# Altium schematic sheet ServoBoard.SchDoc
size A4
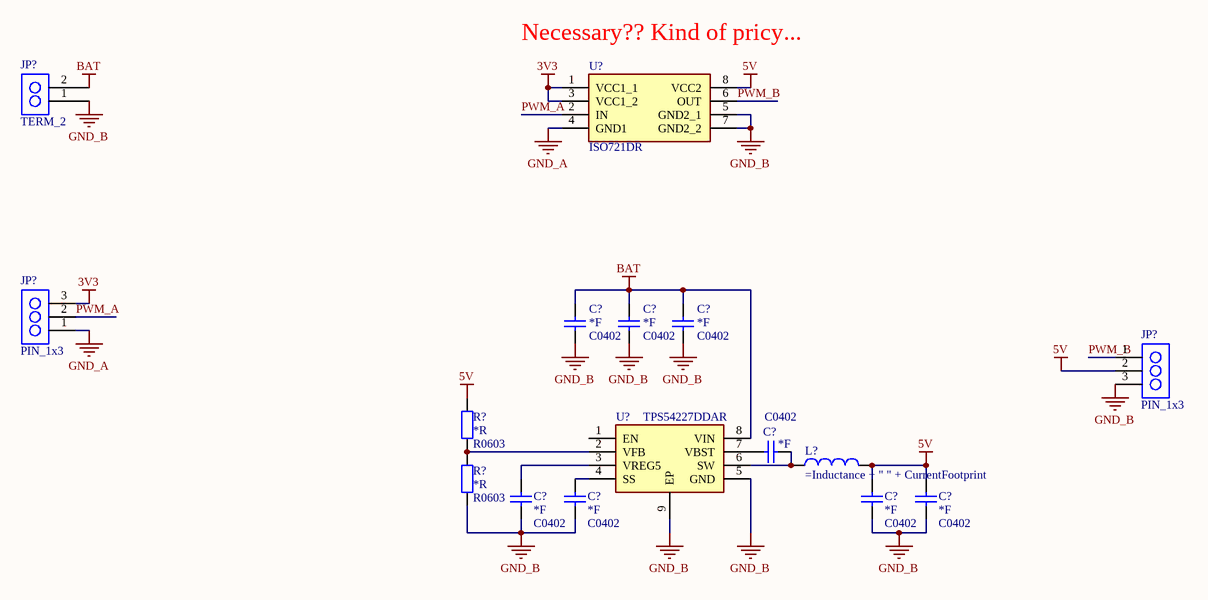
[diagram p0: ServoBoard.SchDoc]

## Parts
(Parts that share a designator on the sheet are numbered #1, #2 ... from top to bottom, then left to right.)
C?#1  Capacitance: *F  [C0402]
C?#2  Capacitance: *F  [C0402]
C?#3  Capacitance: *F  [C0402]
C?#4  Capacitance: *F  [C0402]
C?#5  Capacitance: *F  [C0402]
C?#6  Capacitance: *F  [C0402]
C?#7  Capacitance: *F  [C0402]
C?#8  Capacitance: *F  [C0402]
JP?#1  TERM_2  [TERMINAL 2P]
JP?#2  PIN_1x3  [1.27_1X3R]
JP?#3  PIN_1x3  [1.27_1X3R]
L?  Inductor  [L73]  (value not drawn)
R?#1  *R  [R0603]
R?#2  *R  [R0603]
U?#1  ISO721DR  [SOIC127P600X175-8N]
U?#2  TPS54227DDAR  [SOIC127P600X175-8N]

## Nets
3V3: JP?#2.3 U?#1.1(VCC1_1) U?#1.3(VCC1_2)
5V: C?#7.2 C?#8.2 JP?#3.2 L?.2 R?#1.2 U?#1.8(VCC2)
BAT: C?#1.2 C?#2.2 C?#3.2 JP?#1.2 U?#2.8(VIN)
GND_A: JP?#2.1 U?#1.4(GND1)
GND_B: C?#1.1 C?#2.1 C?#3.1 C?#5.1 C?#6.1 C?#7.1 C?#8.1 JP?#1.1 JP?#3.3 R?#2.1 U?#1.5(GND2_1) U?#1.7(GND2_2) U?#2.5(GND) U?#2.9(EP)
PWM_A: JP?#2.2 U?#1.2(IN)
PWM_B: JP?#3.1 U?#1.6(OUT)
NetC?#4_1: C?#4.1 L?.1 U?#2.6(SW)
NetC?#4_2: C?#4.2 U?#2.7(VBST)
NetC?#5_2: C?#5.2 U?#2.3(VREG5)
NetC?#6_2: C?#6.2 U?#2.4(SS)
NetR?#1_1: R?#1.1 R?#2.2 U?#2.2(VFB)

Not connected (* = marked no-connect by the designer): U?#2 1(EN)

## Notes on the sheet
- (near U?#1) Necessary?? Kind of pricy...
- Title
- Size:
- Date:
- A4
- Number:
- Time:
- Revision:
- Sheet
- of
- File:

## Library data of the parts
C?#1-C?#8 = Capacitor: Ceramic capacitor; Type: MLCC; Voltage rating: *V; ComponentLinknDescription: Datasheet; Characteristic: *; Manufacturer: *; ComponentLinknURL: *; Note: C0402
L? = Inductor: Saturation current: *A; Inductance: *H; DC resistance: *R; Self resonant frequency: *Hz; ComponentLinknDescription: Datasheet; Core material: *; RMS current: *A; Construction: *; ComponentLinknURL: *; Manufacturer: *; Note: =Inductance + " " + CurrentFootprint
R?#1 R?#2 = Resistor: Precision: *%; Voltage rating: *V; Temp coefficient: *ppm; Power rating: *mW; ComponentLinknDescription: Datasheet; Manufacturer: *; ComponentLinknURL: *; Resistance: *R; Note: R0603
U?#1 = ISO721DR: SO72xSingleChannelHigh-SpeedDigitalIsolators; Manufacturer_Name: Texas Instruments; Datasheet Link: http://www.ti.com/lit/gpn/ISO721; Height: 1.75mm; Manufacturer_Part_Number: ISO721DR; Farnell Order Nr: 3124779; PartNumber: ISO721DR
U?#2 = TPS54227DDAR: 4.5-V to 18-V Input, 2-A SynchronousStep-DownConverter; Manufacturer_Name: Texas Instruments; Datasheet Link: http://www.ti.com/lit/gpn/tps54227; Height: 1.7mm; Manufacturer_Part_Number: TPS54227DDAR; PartNumber: TPS54227DDAR; Farnell Order Nr: 3007320
JP?#2 JP?#3 = PIN_1x3: Manufacturer: *; Part Number: *; ComponentLinknDescription: *; ComponentLinknURL: *; Drawn By: Erik Ilbis